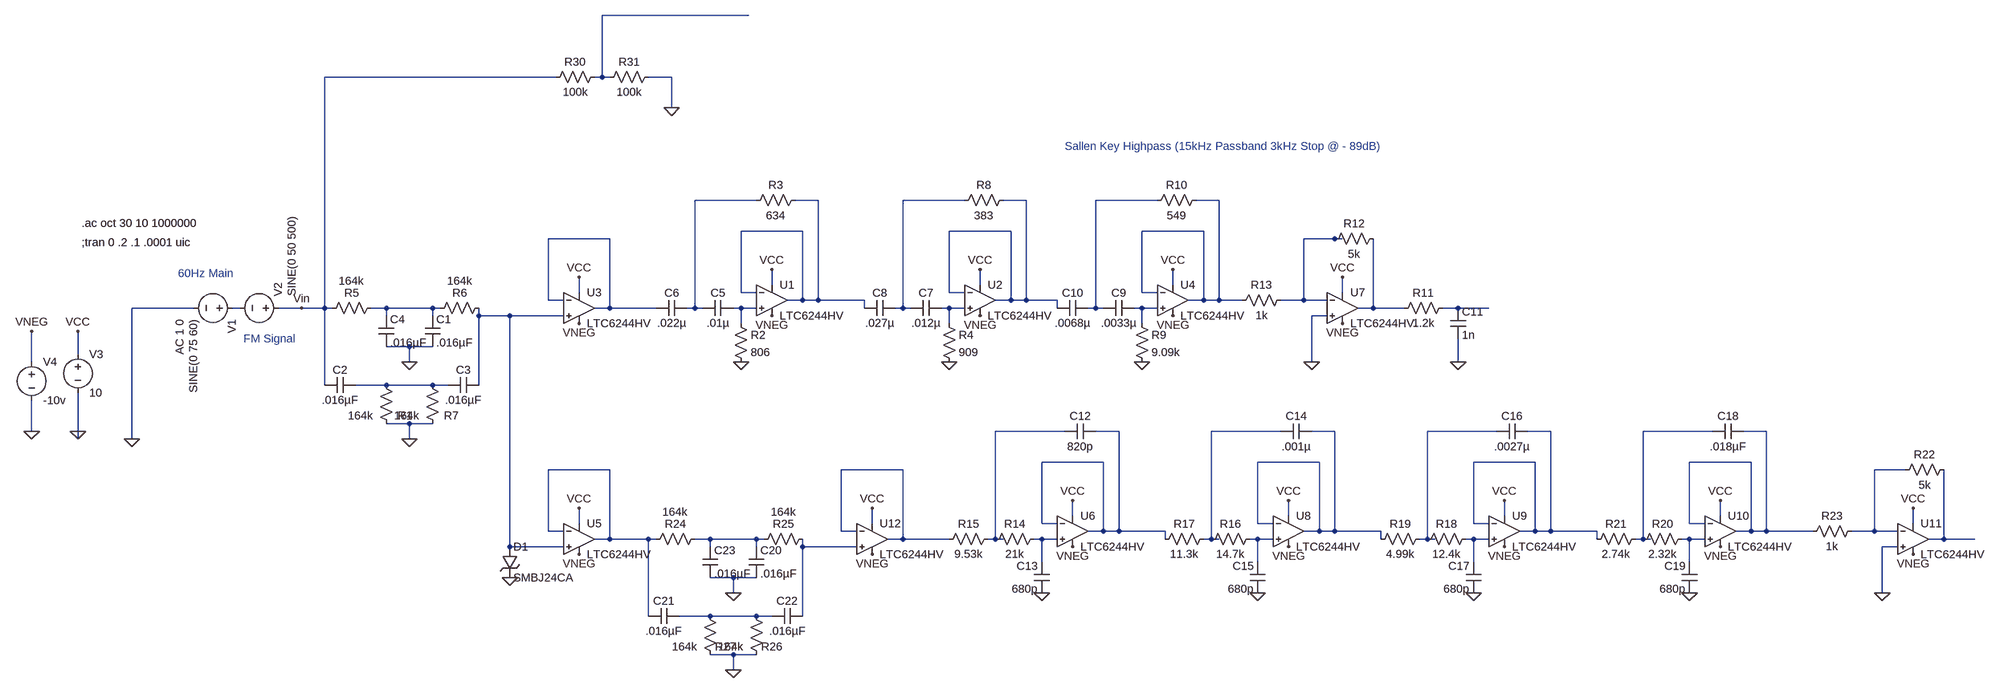
[diagram p0: schematic Isolation.asc]
Isolation.asc, the LTspice schematic file:
Version 4
SHEET 1 3480 1364
WIRE 736 -512 432 -512
WIRE 336 -384 -144 -384
WIRE 432 -384 432 -512
WIRE 432 -384 416 -384
WIRE 448 -384 432 -384
WIRE 576 -384 528 -384
WIRE 576 -320 576 -384
WIRE 752 -128 624 -128
WIRE 880 -128 832 -128
WIRE 1184 -128 1056 -128
WIRE 1312 -128 1264 -128
WIRE 1584 -128 1456 -128
WIRE 1712 -128 1664 -128
WIRE 848 -64 720 -64
WIRE 1280 -64 1152 -64
WIRE 1680 -64 1552 -64
WIRE 448 -48 320 -48
WIRE 1952 -48 1888 -48
WIRE 1968 -48 1952 -48
WIRE 784 48 784 16
WIRE 1216 48 1216 16
WIRE 1616 48 1616 16
WIRE 384 64 384 32
WIRE 720 64 720 -64
WIRE 752 64 720 64
WIRE 1152 64 1152 -64
WIRE 1184 64 1152 64
WIRE 1552 64 1552 -64
WIRE 1584 64 1552 64
WIRE 1968 64 1968 32
WIRE 320 80 320 -48
WIRE 352 80 320 80
WIRE 848 80 848 -64
WIRE 848 80 816 80
WIRE 880 80 880 -128
WIRE 880 80 848 80
WIRE 976 80 880 80
WIRE 1280 80 1280 -64
WIRE 1280 80 1248 80
WIRE 1312 80 1312 -128
WIRE 1312 80 1280 80
WIRE 1376 80 1312 80
WIRE 1680 80 1680 -64
WIRE 1680 80 1648 80
WIRE 1712 80 1712 -128
WIRE 1712 80 1680 80
WIRE 1760 80 1712 80
WIRE 1888 80 1888 -48
WIRE 1888 80 1840 80
WIRE 1936 80 1888 80
WIRE -416 96 -544 96
WIRE -320 96 -336 96
WIRE -192 96 -240 96
WIRE -144 96 -144 -384
WIRE -144 96 -192 96
WIRE -128 96 -144 96
WIRE -16 96 -48 96
WIRE 80 96 -16 96
WIRE 96 96 80 96
WIRE 448 96 448 -48
WIRE 448 96 416 96
WIRE 544 96 448 96
WIRE 624 96 624 -128
WIRE 624 96 608 96
WIRE 640 96 624 96
WIRE 720 96 704 96
WIRE 752 96 720 96
WIRE 976 96 976 80
WIRE 1056 96 1056 -128
WIRE 1056 96 1040 96
WIRE 1072 96 1056 96
WIRE 1152 96 1136 96
WIRE 1184 96 1152 96
WIRE 1376 96 1376 80
WIRE 1456 96 1456 -128
WIRE 1456 96 1440 96
WIRE 1472 96 1456 96
WIRE 1552 96 1536 96
WIRE 1584 96 1552 96
WIRE 2032 96 2032 -48
WIRE 2032 96 2000 96
WIRE 2096 96 2032 96
WIRE 2208 96 2176 96
WIRE 2272 96 2208 96
WIRE -16 112 -16 96
WIRE 80 112 80 96
WIRE 176 112 176 96
WIRE 240 112 176 112
WIRE 352 112 240 112
WIRE 1936 112 1904 112
WIRE 720 128 720 96
WIRE 1152 128 1152 96
WIRE 1552 128 1552 96
WIRE 32 176 -16 176
WIRE 80 176 32 176
WIRE -656 192 -656 144
WIRE -752 208 -752 144
WIRE 32 208 32 176
WIRE 1904 208 1904 112
WIRE 2208 208 2208 160
WIRE -144 256 -144 96
WIRE -16 256 -80 256
WIRE 80 256 -16 256
WIRE 112 256 80 256
WIRE 176 256 176 112
WIRE 32 336 -16 336
WIRE 80 336 32 336
WIRE -752 352 -752 288
WIRE -656 352 -656 272
WIRE 1392 352 1248 352
WIRE 1504 352 1456 352
WIRE 1840 352 1696 352
WIRE 1952 352 1904 352
WIRE 2288 352 2144 352
WIRE 2400 352 2352 352
WIRE 2736 352 2592 352
WIRE 2848 352 2800 352
WIRE -656 368 -656 352
WIRE -544 368 -544 96
WIRE 32 368 32 336
WIRE 1472 416 1344 416
WIRE 1920 416 1792 416
WIRE 2368 416 2240 416
WIRE 2816 416 2688 416
WIRE 448 432 320 432
WIRE 1056 432 928 432
WIRE 3136 432 3072 432
WIRE 1408 528 1408 496
WIRE 1856 528 1856 496
WIRE 2304 528 2304 496
WIRE 2752 528 2752 496
WIRE 384 544 384 512
WIRE 992 544 992 512
WIRE 1344 544 1344 416
WIRE 1376 544 1344 544
WIRE 1792 544 1792 416
WIRE 1824 544 1792 544
WIRE 2240 544 2240 416
WIRE 2272 544 2240 544
WIRE 2688 544 2688 416
WIRE 2720 544 2688 544
WIRE 3152 544 3152 512
WIRE 320 560 320 432
WIRE 352 560 320 560
WIRE 928 560 928 432
WIRE 960 560 928 560
WIRE 1472 560 1472 416
WIRE 1472 560 1440 560
WIRE 1504 560 1504 352
WIRE 1504 560 1472 560
WIRE 1600 560 1504 560
WIRE 1920 560 1920 416
WIRE 1920 560 1888 560
WIRE 1952 560 1952 352
WIRE 1952 560 1920 560
WIRE 2048 560 1952 560
WIRE 2368 560 2368 416
WIRE 2368 560 2336 560
WIRE 2400 560 2400 352
WIRE 2400 560 2368 560
WIRE 2496 560 2400 560
WIRE 2816 560 2816 416
WIRE 2816 560 2784 560
WIRE 2848 560 2848 352
WIRE 2848 560 2816 560
WIRE 2944 560 2848 560
WIRE 3072 560 3072 432
WIRE 3072 560 3024 560
WIRE 3120 560 3072 560
WIRE 448 576 448 432
WIRE 448 576 416 576
WIRE 528 576 448 576
WIRE 544 576 528 576
WIRE 656 576 624 576
WIRE 752 576 656 576
WIRE 768 576 752 576
WIRE 1056 576 1056 432
WIRE 1056 576 1024 576
WIRE 1152 576 1056 576
WIRE 1248 576 1248 352
WIRE 1248 576 1232 576
WIRE 1264 576 1248 576
WIRE 1344 576 1328 576
WIRE 1376 576 1344 576
WIRE 1600 576 1600 560
WIRE 1696 576 1696 352
WIRE 1696 576 1680 576
WIRE 1712 576 1696 576
WIRE 1792 576 1776 576
WIRE 1824 576 1792 576
WIRE 2048 576 2048 560
WIRE 2144 576 2144 352
WIRE 2144 576 2128 576
WIRE 2160 576 2144 576
WIRE 2240 576 2224 576
WIRE 2272 576 2240 576
WIRE 2496 576 2496 560
WIRE 2592 576 2592 352
WIRE 2592 576 2576 576
WIRE 2608 576 2592 576
WIRE 2688 576 2672 576
WIRE 2720 576 2688 576
WIRE 3216 576 3216 432
WIRE 3216 576 3184 576
WIRE 3280 576 3216 576
WIRE 240 592 240 112
WIRE 352 592 240 592
WIRE 656 592 656 576
WIRE 752 592 752 576
WIRE 848 592 848 576
WIRE 960 592 848 592
WIRE 3120 592 3088 592
WIRE 1344 624 1344 576
WIRE 1792 624 1792 576
WIRE 2240 624 2240 576
WIRE 2688 624 2688 576
WIRE 704 656 656 656
WIRE 752 656 704 656
WIRE 704 688 704 656
WIRE 3088 688 3088 592
WIRE 528 736 528 576
WIRE 656 736 592 736
WIRE 752 736 656 736
WIRE 784 736 752 736
WIRE 848 736 848 592
WIRE 704 816 656 816
WIRE 752 816 704 816
WIRE 704 848 704 816
FLAG -544 368 0
FLAG -192 96 Vin
FLAG 32 208 0
FLAG 32 368 0
FLAG -656 352 0
FLAG -752 352 0
FLAG -656 144 VCC
FLAG -752 144 VNEG
FLAG 384 32 VCC
FLAG 384 128 VNEG
FLAG 384 512 VCC
FLAG 384 608 VNEG
FLAG 784 16 VCC
FLAG 784 112 VNEG
FLAG 720 208 0
FLAG 1216 16 VCC
FLAG 1216 112 VNEG
FLAG 1152 208 0
FLAG 1616 16 VCC
FLAG 1616 112 VNEG
FLAG 1552 208 0
FLAG 1968 32 VCC
FLAG 1968 128 VNEG
FLAG 1904 208 0
FLAG 2208 208 0
FLAG 1408 496 VCC
FLAG 1408 592 VNEG
FLAG 1344 688 0
FLAG 1856 496 VCC
FLAG 1856 592 VNEG
FLAG 1792 688 0
FLAG 2304 496 VCC
FLAG 2304 592 VNEG
FLAG 2240 688 0
FLAG 2752 496 VCC
FLAG 2752 592 VNEG
FLAG 2688 688 0
FLAG 3152 512 VCC
FLAG 3152 608 VNEG
FLAG 3088 688 0
FLAG 704 688 0
FLAG 704 848 0
FLAG 992 512 VCC
FLAG 992 608 VNEG
FLAG 240 656 0
FLAG 576 -320 0
SYMBOL voltage -320 96 R90
WINDOW 123 24 124 Left 2
WINDOW 39 0 0 Left 2
SYMATTR Value2 AC 1 0
SYMATTR InstName V1
SYMATTR Value SINE(0 75 60)
SYMBOL voltage -224 96 M270
WINDOW 39 0 0 Left 2
WINDOW 3 24 -12 Left 2
WINDOW 123 0 0 Left 2
SYMATTR Value SINE(0 50 500)
SYMATTR InstName V2
SYMBOL res -32 80 R90
WINDOW 0 0 56 VBottom 2
WINDOW 3 -56 57 VTop 2
SYMATTR InstName R5
SYMATTR Value 164k
SYMBOL res 192 80 R90
WINDOW 0 0 56 VBottom 2
WINDOW 3 -56 56 VTop 2
SYMATTR InstName R6
SYMATTR Value 164k
SYMBOL res 96 352 R180
WINDOW 0 -38 32 Left 2
WINDOW 3 43 32 Left 2
SYMATTR InstName R7
SYMATTR Value 164k
SYMBOL cap 64 112 R0
SYMATTR InstName C1
SYMATTR Value .016µF
SYMBOL cap -80 240 R90
WINDOW 0 0 32 VBottom 2
WINDOW 3 32 32 VTop 2
SYMATTR InstName C2
SYMATTR Value .016µF
SYMATTR SpiceLine Rser=3.9
SYMBOL cap 176 240 R90
WINDOW 0 0 32 VBottom 2
WINDOW 3 32 32 VTop 2
SYMATTR InstName C3
SYMATTR Value .016µF
SYMATTR SpiceLine Rser=3.9
SYMBOL voltage -656 176 R0
WINDOW 123 0 0 Left 2
WINDOW 39 0 0 Left 2
SYMATTR InstName V3
SYMATTR Value 10
SYMBOL voltage -752 192 R0
WINDOW 123 0 0 Left 2
WINDOW 39 0 0 Left 2
SYMATTR InstName V4
SYMATTR Value -10v
SYMBOL cap -32 112 R0
SYMATTR InstName C4
SYMATTR Value .016µF
SYMBOL res 0 352 R180
WINDOW 0 -38 32 Left 2
WINDOW 3 43 32 Left 2
SYMATTR InstName R1
SYMATTR Value 164k
SYMBOL Opamps\\LTC6244HV 384 96 R0
SYMATTR InstName U3
SYMBOL Opamps\\LTC6244HV 384 576 R0
SYMATTR InstName U5
SYMBOL Opamps\\LTC6244HV 784 80 R0
SYMATTR InstName U1
SYMBOL cap 704 80 R90
WINDOW 0 0 32 VBottom 2
WINDOW 3 32 32 VTop 2
SYMATTR InstName C5
SYMATTR Value .01µ
SYMBOL cap 608 80 R90
WINDOW 0 0 32 VBottom 2
WINDOW 3 32 32 VTop 2
SYMATTR InstName C6
SYMATTR Value .022µ
SYMBOL res 704 112 R0
SYMATTR InstName R2
SYMATTR Value 806
SYMBOL res 848 -144 R90
WINDOW 0 0 56 VBottom 2
WINDOW 3 32 56 VTop 2
SYMATTR InstName R3
SYMATTR Value 634
SYMBOL Opamps\\LTC6244HV 1216 80 R0
SYMATTR InstName U2
SYMBOL cap 1136 80 R90
WINDOW 0 0 32 VBottom 2
WINDOW 3 32 32 VTop 2
SYMATTR InstName C7
SYMATTR Value .012µ
SYMBOL cap 1040 80 R90
WINDOW 0 0 32 VBottom 2
WINDOW 3 32 32 VTop 2
SYMATTR InstName C8
SYMATTR Value .027µ
SYMBOL res 1136 112 R0
SYMATTR InstName R4
SYMATTR Value 909
SYMBOL res 1280 -144 R90
WINDOW 0 0 56 VBottom 2
WINDOW 3 32 56 VTop 2
SYMATTR InstName R8
SYMATTR Value 383
SYMBOL Opamps\\LTC6244HV 1616 80 R0
SYMATTR InstName U4
SYMBOL cap 1536 80 R90
WINDOW 0 0 32 VBottom 2
WINDOW 3 32 32 VTop 2
SYMATTR InstName C9
SYMATTR Value .0033µ
SYMBOL cap 1440 80 R90
WINDOW 0 0 32 VBottom 2
WINDOW 3 32 32 VTop 2
SYMATTR InstName C10
SYMATTR Value .0068µ
SYMBOL res 1536 112 R0
SYMATTR InstName R9
SYMATTR Value 9.09k
SYMBOL res 1680 -144 R90
WINDOW 0 0 56 VBottom 2
WINDOW 3 32 56 VTop 2
SYMATTR InstName R10
SYMATTR Value 549
SYMBOL Opamps\\LTC6244HV 1968 96 R0
SYMATTR InstName U7
SYMBOL res 2048 -64 R90
WINDOW 0 0 56 VBottom 2
WINDOW 3 32 56 VTop 2
SYMATTR InstName R12
SYMATTR Value 5k
SYMBOL res 1856 64 R90
WINDOW 0 0 56 VBottom 2
WINDOW 3 32 56 VTop 2
SYMATTR InstName R13
SYMATTR Value 1k
SYMBOL res 2192 80 R90
WINDOW 0 0 56 VBottom 2
WINDOW 3 32 56 VTop 2
SYMATTR InstName R11
SYMATTR Value 1.2k
SYMBOL cap 2192 96 R0
SYMATTR InstName C11
SYMATTR Value 1n
SYMBOL Opamps\\LTC6244HV 1408 560 R0
SYMATTR InstName U6
SYMBOL res 1344 560 R90
WINDOW 0 0 56 VBottom 2
WINDOW 3 32 56 VTop 2
SYMATTR InstName R14
SYMATTR Value 21k
SYMBOL res 1248 560 R90
WINDOW 0 0 56 VBottom 2
WINDOW 3 32 56 VTop 2
SYMATTR InstName R15
SYMATTR Value 9.53k
SYMBOL cap 1456 336 R90
WINDOW 0 0 32 VBottom 2
WINDOW 3 32 32 VTop 2
SYMATTR InstName C12
SYMATTR Value 820p
SYMBOL cap 1360 688 R180
WINDOW 0 24 56 Left 2
WINDOW 3 24 8 Left 2
SYMATTR InstName C13
SYMATTR Value 680p
SYMBOL Opamps\\LTC6244HV 1856 560 R0
SYMATTR InstName U8
SYMBOL res 1792 560 R90
WINDOW 0 0 56 VBottom 2
WINDOW 3 32 56 VTop 2
SYMATTR InstName R16
SYMATTR Value 14.7k
SYMBOL res 1696 560 R90
WINDOW 0 0 56 VBottom 2
WINDOW 3 32 56 VTop 2
SYMATTR InstName R17
SYMATTR Value 11.3k
SYMBOL cap 1904 336 R90
WINDOW 0 0 32 VBottom 2
WINDOW 3 32 32 VTop 2
SYMATTR InstName C14
SYMATTR Value .001µ
SYMBOL cap 1808 688 R180
WINDOW 0 24 56 Left 2
WINDOW 3 24 8 Left 2
SYMATTR InstName C15
SYMATTR Value 680p
SYMBOL Opamps\\LTC6244HV 2304 560 R0
SYMATTR InstName U9
SYMBOL res 2240 560 R90
WINDOW 0 0 56 VBottom 2
WINDOW 3 32 56 VTop 2
SYMATTR InstName R18
SYMATTR Value 12.4k
SYMBOL res 2144 560 R90
WINDOW 0 0 56 VBottom 2
WINDOW 3 32 56 VTop 2
SYMATTR InstName R19
SYMATTR Value 4.99k
SYMBOL cap 2352 336 R90
WINDOW 0 0 32 VBottom 2
WINDOW 3 32 32 VTop 2
SYMATTR InstName C16
SYMATTR Value .0027µ
SYMBOL cap 2256 688 R180
WINDOW 0 24 56 Left 2
WINDOW 3 24 8 Left 2
SYMATTR InstName C17
SYMATTR Value 680p
SYMBOL Opamps\\LTC6244HV 2752 560 R0
SYMATTR InstName U10
SYMBOL res 2688 560 R90
WINDOW 0 0 56 VBottom 2
WINDOW 3 32 56 VTop 2
SYMATTR InstName R20
SYMATTR Value 2.32k
SYMBOL res 2592 560 R90
WINDOW 0 0 56 VBottom 2
WINDOW 3 32 56 VTop 2
SYMATTR InstName R21
SYMATTR Value 2.74k
SYMBOL cap 2800 336 R90
WINDOW 0 0 32 VBottom 2
WINDOW 3 32 32 VTop 2
SYMATTR InstName C18
SYMATTR Value .018µF
SYMBOL cap 2704 688 R180
WINDOW 0 24 56 Left 2
WINDOW 3 24 8 Left 2
SYMATTR InstName C19
SYMATTR Value 680p
SYMBOL Opamps\\LTC6244HV 3152 576 R0
SYMATTR InstName U11
SYMBOL res 3232 416 R90
WINDOW 0 0 56 VBottom 2
WINDOW 3 32 56 VTop 2
SYMATTR InstName R22
SYMATTR Value 5k
SYMBOL res 3040 544 R90
WINDOW 0 0 56 VBottom 2
WINDOW 3 32 56 VTop 2
SYMATTR InstName R23
SYMATTR Value 1k
SYMBOL res 640 560 R90
WINDOW 0 0 56 VBottom 2
WINDOW 3 -56 57 VTop 2
SYMATTR InstName R24
SYMATTR Value 164k
SYMBOL res 864 560 R90
WINDOW 0 0 56 VBottom 2
WINDOW 3 -56 56 VTop 2
SYMATTR InstName R25
SYMATTR Value 164k
SYMBOL res 768 832 R180
WINDOW 0 -38 32 Left 2
WINDOW 3 43 32 Left 2
SYMATTR InstName R26
SYMATTR Value 164k
SYMBOL cap 736 592 R0
SYMATTR InstName C20
SYMATTR Value .016µF
SYMBOL cap 592 720 R90
WINDOW 0 0 32 VBottom 2
WINDOW 3 32 32 VTop 2
SYMATTR InstName C21
SYMATTR Value .016µF
SYMATTR SpiceLine Rser=3.9
SYMBOL cap 848 720 R90
WINDOW 0 0 32 VBottom 2
WINDOW 3 32 32 VTop 2
SYMATTR InstName C22
SYMATTR Value .016µF
SYMATTR SpiceLine Rser=3.9
SYMBOL cap 640 592 R0
SYMATTR InstName C23
SYMATTR Value .016µF
SYMBOL res 672 832 R180
WINDOW 0 -38 32 Left 2
WINDOW 3 43 32 Left 2
SYMATTR InstName R27
SYMATTR Value 164k
SYMBOL Opamps\\LTC6244HV 992 576 R0
SYMATTR InstName U12
SYMBOL TVSdiode 224 592 R0
WINDOW 0 24 0 Left 2
WINDOW 3 24 64 Left 2
SYMATTR InstName D1
SYMATTR Value SMBJ24CA
SYMATTR Description Diode
SYMATTR Type diode
SYMBOL res 432 -400 R90
WINDOW 0 0 56 VBottom 2
WINDOW 3 32 56 VTop 2
SYMATTR InstName R30
SYMATTR Value 100k
SYMBOL res 432 -368 R270
WINDOW 0 32 56 VTop 2
WINDOW 3 0 56 VBottom 2
SYMATTR InstName R31
SYMATTR Value 100k
TEXT -648 -40 Left 2 !;tran 0 .2 .1 .0001 uic
TEXT -312 160 Left 2 ;FM Signal
TEXT -448 24 Left 2 ;60Hz Main
TEXT -648 -80 Left 2 !.ac oct 30 10 1000000
TEXT 1392 -240 Left 2 ;Sallen Key Highpass (15kHz Passband 3kHz Stop @ - 89dB)

The netlist it stands for:
* Isolation.asc
V1 N010 0 SINE(0 75 60) AC 1 0
V2 Vin N010 SINE(0 50 500)
R5 N011 Vin 164k
R6 N017 N011 164k
R7 0 N018 164k
C1 N011 0 .016µF
C2 N018 Vin .016µF Rser=3.9
C3 N017 N018 .016µF Rser=3.9
V3 VCC 0 10
V4 VNEG 0 -10v
C4 N011 0 .016µF
R1 0 N018 164k
XU3 N017 N008 VCC VNEG N008 LTC6244HV  ; pins In+ In- V+ V- OUT
XU5 N017 N027 VCC VNEG N027 LTC6244HV  ; pins In+ In- V+ V- OUT
XU1 N012 N003 VCC VNEG N003 LTC6244HV  ; pins In+ In- V+ V- OUT
C5 N012 N002 .01µ
C6 N002 N008 .022µ
R2 N012 0 806
R3 N003 N002 634
XU2 N013 N005 VCC VNEG N005 LTC6244HV  ; pins In+ In- V+ V- OUT
C7 N013 N004 .012µ
C8 N004 N003 .027µ
R4 N013 0 909
R8 N005 N004 383
XU4 N014 N007 VCC VNEG N007 LTC6244HV  ; pins In+ In- V+ V- OUT
C9 N014 N006 .0033µ
C10 N006 N005 .0068µ
R9 N014 0 9.09k
R10 N007 N006 549
XU7 0 N009 VCC VNEG N015 LTC6244HV  ; pins In+ In- V+ V- OUT
R12 N015 N009 5k
R13 N009 N007 1k
R11 N016 N015 1.2k
C11 N016 0 1n
XU6 N031 N020 VCC VNEG N020 LTC6244HV  ; pins In+ In- V+ V- OUT
R14 N031 N019 21k
R15 N019 N028 9.53k
C12 N020 N019 820p
C13 0 N031 680p
XU8 N032 N022 VCC VNEG N022 LTC6244HV  ; pins In+ In- V+ V- OUT
R16 N032 N021 14.7k
R17 N021 N020 11.3k
C14 N022 N021 .001µ
C15 0 N032 680p
XU9 N033 N024 VCC VNEG N024 LTC6244HV  ; pins In+ In- V+ V- OUT
R18 N033 N023 12.4k
R19 N023 N022 4.99k
C16 N024 N023 .0027µ
C17 0 N033 680p
XU10 N034 N026 VCC VNEG N026 LTC6244HV  ; pins In+ In- V+ V- OUT
R20 N034 N025 2.32k
R21 N025 N024 2.74k
C18 N026 N025 .018µF
C19 0 N034 680p
XU11 0 N029 VCC VNEG N035 LTC6244HV  ; pins In+ In- V+ V- OUT
R22 N035 N029 5k
R23 N029 N026 1k
R24 N030 N027 164k
R25 N036 N030 164k
R26 0 N037 164k
C20 N030 0 .016µF
C21 N037 N027 .016µF Rser=3.9
C22 N036 N037 .016µF Rser=3.9
C23 N030 0 .016µF
R27 0 N037 164k
XU12 N036 N028 VCC VNEG N028 LTC6244HV  ; pins In+ In- V+ V- OUT
D1 N017 0 SMBJ24CA
R30 N001 Vin 100k
R31 N001 0 100k
.model D D
.lib standard.dio
;tran 0 .2 .1 .0001 uic
* FM Signal
* 60Hz Main
.ac oct 30 10 1000000
* Sallen Key Highpass (15kHz Passband 3kHz Stop @ - 89dB)
.lib LTC5.lib
.backanno
.end